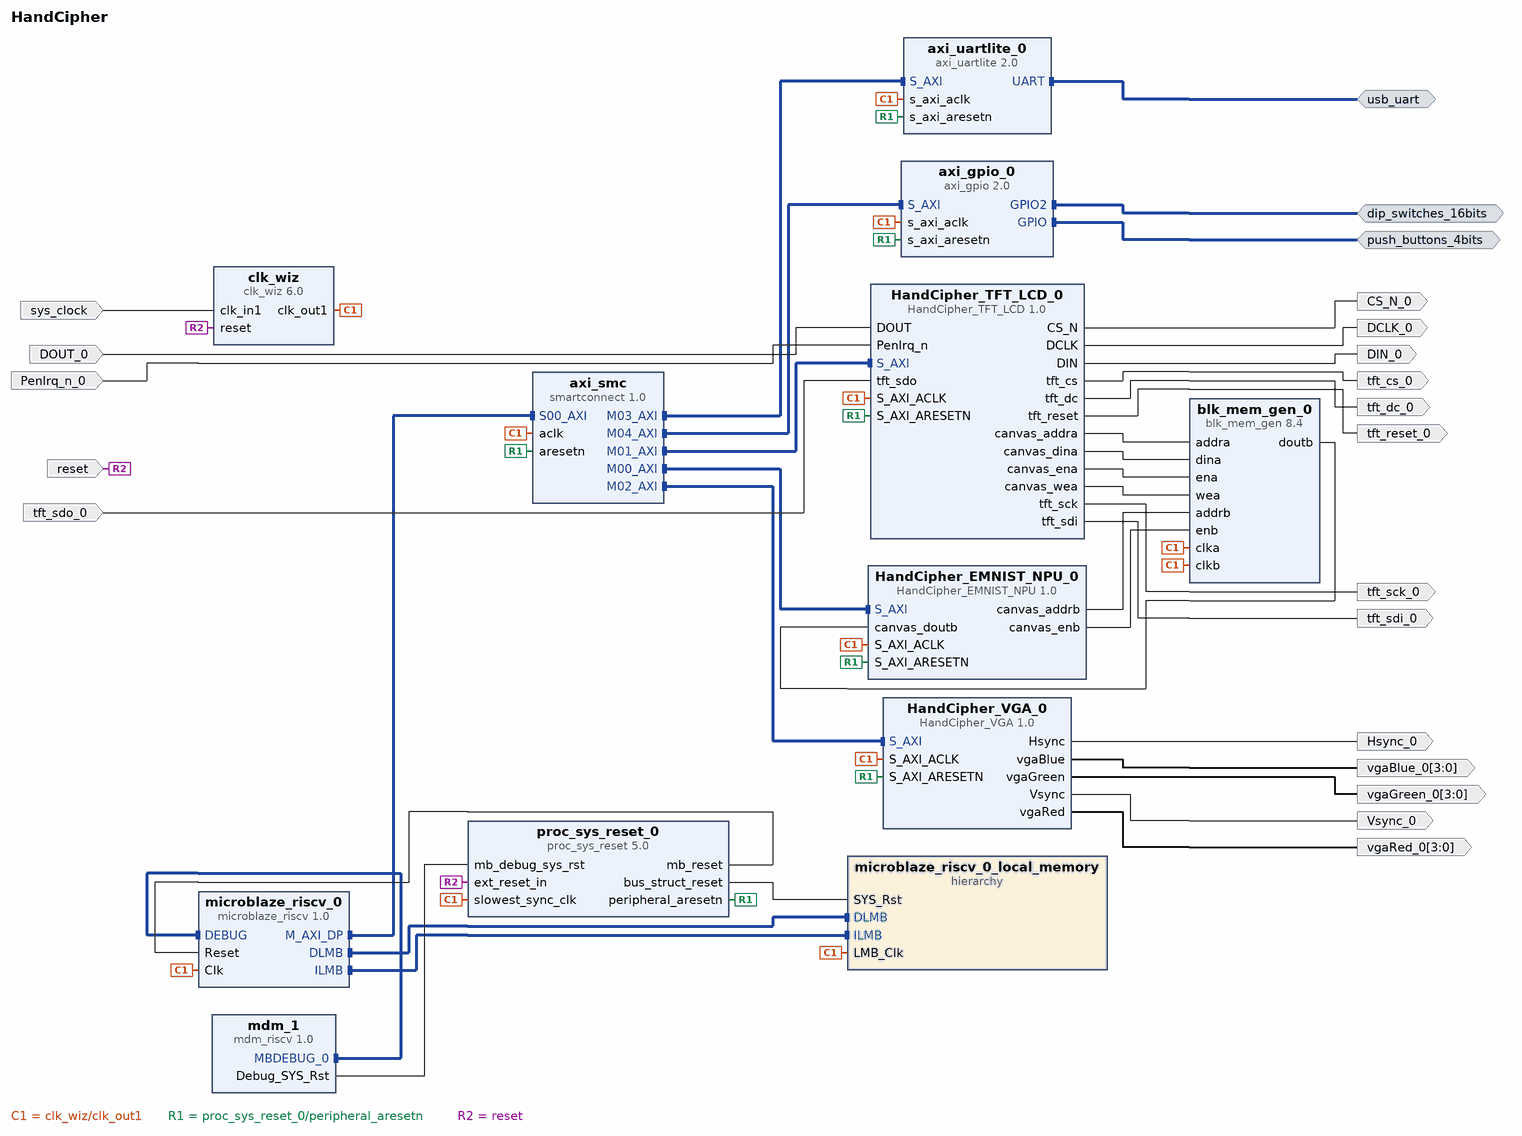
[diagram p0: block diagram of the top level]
# Vivado block design HandCipher, xc7a35tcpg236-1, Vivado 2024.2
create_bd_design HandCipher

create_bd_intf_port -mode Master -vlnv xilinx.com:interface:uart_rtl:1.0 usb_uart
create_bd_intf_port -mode Master -vlnv xilinx.com:interface:gpio_rtl:1.0 push_buttons_4bits
create_bd_intf_port -mode Master -vlnv xilinx.com:interface:gpio_rtl:1.0 dip_switches_16bits
create_bd_port -dir I -type rst reset
set_property -dict {CONFIG.POLARITY ACTIVE_HIGH} [get_bd_ports reset]
create_bd_port -dir I -type clk sys_clock
set_property -dict {CONFIG.FREQ_HZ 100000000 CONFIG.PHASE 0.0} [get_bd_ports sys_clock]
create_bd_port -dir I tft_sdo_0
create_bd_port -dir I PenIrq_n_0
create_bd_port -dir I DOUT_0
create_bd_port -dir O -from 3 -to 0 vgaRed_0
create_bd_port -dir O -from 3 -to 0 vgaGreen_0
create_bd_port -dir O -from 3 -to 0 vgaBlue_0
create_bd_port -dir O Hsync_0
create_bd_port -dir O Vsync_0
create_bd_port -dir O tft_sck_0
create_bd_port -dir O tft_sdi_0
create_bd_port -dir O tft_dc_0
create_bd_port -dir O -type rst tft_reset_0
create_bd_port -dir O tft_cs_0
create_bd_port -dir O DCLK_0
create_bd_port -dir O DIN_0
create_bd_port -dir O CS_N_0

create_bd_cell -type ip -vlnv xilinx.com:ip:proc_sys_reset:5.0 proc_sys_reset_0
set_property -dict {CONFIG.RESET_BOARD_INTERFACE reset CONFIG.USE_BOARD_FLOW true} [get_bd_cells proc_sys_reset_0]
create_bd_cell -type ip -vlnv xilinx.com:ip:clk_wiz:6.0 clk_wiz
set_property -dict [list \
  CONFIG.CLKOUT1_REQUESTED_OUT_FREQ 100.0 \
  CONFIG.CLK_IN1_BOARD_INTERFACE sys_clock \
  CONFIG.RESET_BOARD_INTERFACE reset \
  CONFIG.USE_BOARD_FLOW true \
] [get_bd_cells clk_wiz]
create_bd_cell -type ip -vlnv xilinx.com:ip:mdm_riscv:1.0 mdm_1
create_bd_cell -type ip -vlnv user.org:user:HandCipher_EMNIST_NPU:1.0 HandCipher_EMNIST_NPU_0
create_bd_cell -type ip -vlnv xilinx.com:ip:smartconnect:1.0 axi_smc
set_property -dict {CONFIG.NUM_MI 5 CONFIG.NUM_SI 1} [get_bd_cells axi_smc]
create_bd_cell -type ip -vlnv user.org:user:HandCipher_TFT_LCD:1.0 HandCipher_TFT_LCD_0
create_bd_cell -type ip -vlnv user.org:user:HandCipher_VGA:1.0 HandCipher_VGA_0
create_bd_cell -type ip -vlnv xilinx.com:ip:axi_uartlite:2.0 axi_uartlite_0
set_property -dict {CONFIG.UARTLITE_BOARD_INTERFACE usb_uart CONFIG.USE_BOARD_FLOW true} [get_bd_cells axi_uartlite_0]
create_bd_cell -type ip -vlnv xilinx.com:ip:blk_mem_gen:8.4 blk_mem_gen_0
set_property -dict [list \
  CONFIG.Memory_Type True_Dual_Port_RAM \
  CONFIG.Write_Depth_A 1024 \
  CONFIG.Write_Width_A 1 \
  CONFIG.use_bram_block Stand_Alone \
] [get_bd_cells blk_mem_gen_0]
create_bd_cell -type ip -vlnv xilinx.com:ip:microblaze_riscv:1.0 microblaze_riscv_0
set_property -dict {CONFIG.C_DEBUG_ENABLED 1 CONFIG.C_D_AXI 1 CONFIG.C_D_LMB 1 CONFIG.C_I_LMB 1} [get_bd_cells microblaze_riscv_0]
create_bd_cell -type hier microblaze_riscv_0_local_memory
create_bd_cell -type ip -vlnv xilinx.com:ip:axi_gpio:2.0 axi_gpio_0
set_property -dict [list \
  CONFIG.GPIO2_BOARD_INTERFACE dip_switches_16bits \
  CONFIG.GPIO_BOARD_INTERFACE push_buttons_4bits \
  CONFIG.USE_BOARD_FLOW true \
] [get_bd_cells axi_gpio_0]

# ---- hierarchy /microblaze_riscv_0_local_memory ----
current_bd_instance /microblaze_riscv_0_local_memory
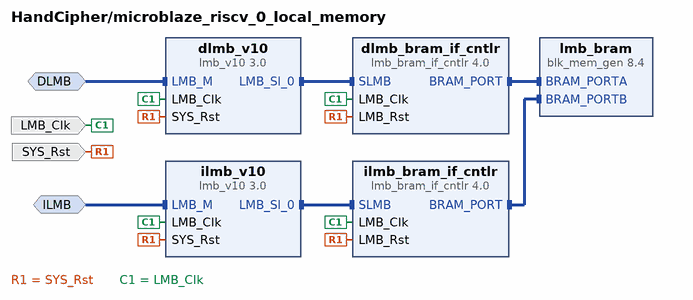
[diagram p1: block diagram inside /microblaze_riscv_0_local_memory]
create_bd_intf_pin -mode MirroredMaster -vlnv xilinx.com:interface:lmb_rtl:1.0 DLMB
create_bd_intf_pin -mode MirroredMaster -vlnv xilinx.com:interface:lmb_rtl:1.0 ILMB
create_bd_pin -dir I -type clk LMB_Clk
create_bd_pin -dir I -type rst SYS_Rst

create_bd_cell -type ip -vlnv xilinx.com:ip:lmb_v10:3.0 dlmb_v10
create_bd_cell -type ip -vlnv xilinx.com:ip:lmb_v10:3.0 ilmb_v10
create_bd_cell -type ip -vlnv xilinx.com:ip:lmb_bram_if_cntlr:4.0 dlmb_bram_if_cntlr
set_property -dict {CONFIG.C_ECC 0} [get_bd_cells dlmb_bram_if_cntlr]
create_bd_cell -type ip -vlnv xilinx.com:ip:lmb_bram_if_cntlr:4.0 ilmb_bram_if_cntlr
set_property -dict {CONFIG.C_ECC 0} [get_bd_cells ilmb_bram_if_cntlr]
create_bd_cell -type ip -vlnv xilinx.com:ip:blk_mem_gen:8.4 lmb_bram
set_property -dict {CONFIG.Memory_Type True_Dual_Port_RAM CONFIG.use_bram_block BRAM_Controller} [get_bd_cells lmb_bram]

# ---- connections ----

current_bd_instance /microblaze_riscv_0_local_memory
connect_bd_intf_net -intf_net microblaze_riscv_0_dlmb [get_bd_intf_pins dlmb_v10/LMB_M] [get_bd_intf_pins DLMB]
connect_bd_intf_net -intf_net microblaze_riscv_0_dlmb_bus [get_bd_intf_pins dlmb_v10/LMB_Sl_0] [get_bd_intf_pins dlmb_bram_if_cntlr/SLMB]
connect_bd_intf_net -intf_net microblaze_riscv_0_dlmb_cntlr [get_bd_intf_pins dlmb_bram_if_cntlr/BRAM_PORT] [get_bd_intf_pins lmb_bram/BRAM_PORTA]
connect_bd_intf_net -intf_net microblaze_riscv_0_ilmb [get_bd_intf_pins ilmb_v10/LMB_M] [get_bd_intf_pins ILMB]
connect_bd_intf_net -intf_net microblaze_riscv_0_ilmb_bus [get_bd_intf_pins ilmb_v10/LMB_Sl_0] [get_bd_intf_pins ilmb_bram_if_cntlr/SLMB]
connect_bd_intf_net -intf_net microblaze_riscv_0_ilmb_cntlr [get_bd_intf_pins ilmb_bram_if_cntlr/BRAM_PORT] [get_bd_intf_pins lmb_bram/BRAM_PORTB]
connect_bd_net [get_bd_pins SYS_Rst] \
  [get_bd_pins dlmb_v10/SYS_Rst] [get_bd_pins ilmb_v10/SYS_Rst] [get_bd_pins ilmb_bram_if_cntlr/LMB_Rst] \
  [get_bd_pins dlmb_bram_if_cntlr/LMB_Rst]
connect_bd_net -net microblaze_riscv_0_Clk [get_bd_pins LMB_Clk] \
  [get_bd_pins dlmb_v10/LMB_Clk] [get_bd_pins ilmb_v10/LMB_Clk] [get_bd_pins ilmb_bram_if_cntlr/LMB_Clk] \
  [get_bd_pins dlmb_bram_if_cntlr/LMB_Clk]
set_property HDL_ATTRIBUTE.BMM_INFO_ADDRESS_SPACE {byte  0x00000000 32 > HandCipher microblaze_riscv_0_local_memory/lmb_bram} [get_bd_cells dlmb_bram_if_cntlr]
set_property HDL_ATTRIBUTE.KEEP_HIERARCHY yes [get_bd_cells dlmb_bram_if_cntlr]

current_bd_instance /
connect_bd_intf_net [get_bd_intf_ports push_buttons_4bits] [get_bd_intf_pins axi_gpio_0/GPIO]
connect_bd_intf_net [get_bd_intf_ports dip_switches_16bits] [get_bd_intf_pins axi_gpio_0/GPIO2]
connect_bd_intf_net [get_bd_intf_pins axi_smc/M00_AXI] [get_bd_intf_pins HandCipher_EMNIST_NPU_0/S_AXI]
connect_bd_intf_net [get_bd_intf_pins axi_smc/M01_AXI] [get_bd_intf_pins HandCipher_TFT_LCD_0/S_AXI]
connect_bd_intf_net [get_bd_intf_pins axi_smc/M02_AXI] [get_bd_intf_pins HandCipher_VGA_0/S_AXI]
connect_bd_intf_net [get_bd_intf_pins axi_smc/M03_AXI] [get_bd_intf_pins axi_uartlite_0/S_AXI]
connect_bd_intf_net [get_bd_intf_pins axi_smc/M04_AXI] [get_bd_intf_pins axi_gpio_0/S_AXI]
connect_bd_intf_net [get_bd_intf_ports usb_uart] [get_bd_intf_pins axi_uartlite_0/UART]
connect_bd_intf_net [get_bd_intf_pins microblaze_riscv_0/M_AXI_DP] [get_bd_intf_pins axi_smc/S00_AXI]
connect_bd_intf_net [get_bd_intf_pins mdm_1/MBDEBUG_0] [get_bd_intf_pins microblaze_riscv_0/DEBUG]
connect_bd_intf_net [get_bd_intf_pins microblaze_riscv_0/DLMB] [get_bd_intf_pins microblaze_riscv_0_local_memory/DLMB]
connect_bd_intf_net [get_bd_intf_pins microblaze_riscv_0/ILMB] [get_bd_intf_pins microblaze_riscv_0_local_memory/ILMB]
connect_bd_net -net DOUT_0_1 [get_bd_ports DOUT_0] [get_bd_pins HandCipher_TFT_LCD_0/DOUT]
connect_bd_net [get_bd_pins HandCipher_EMNIST_NPU_0/canvas_addrb] [get_bd_pins blk_mem_gen_0/addrb]
connect_bd_net [get_bd_pins HandCipher_EMNIST_NPU_0/canvas_enb] [get_bd_pins blk_mem_gen_0/enb]
connect_bd_net [get_bd_pins HandCipher_TFT_LCD_0/CS_N] [get_bd_ports CS_N_0]
connect_bd_net [get_bd_pins HandCipher_TFT_LCD_0/DCLK] [get_bd_ports DCLK_0]
connect_bd_net [get_bd_pins HandCipher_TFT_LCD_0/DIN] [get_bd_ports DIN_0]
connect_bd_net [get_bd_pins HandCipher_TFT_LCD_0/canvas_addra] [get_bd_pins blk_mem_gen_0/addra]
connect_bd_net [get_bd_pins HandCipher_TFT_LCD_0/canvas_dina] [get_bd_pins blk_mem_gen_0/dina]
connect_bd_net [get_bd_pins HandCipher_TFT_LCD_0/canvas_ena] [get_bd_pins blk_mem_gen_0/ena]
connect_bd_net [get_bd_pins HandCipher_TFT_LCD_0/canvas_wea] [get_bd_pins blk_mem_gen_0/wea]
connect_bd_net [get_bd_pins HandCipher_TFT_LCD_0/tft_cs] [get_bd_ports tft_cs_0]
connect_bd_net [get_bd_pins HandCipher_TFT_LCD_0/tft_dc] [get_bd_ports tft_dc_0]
connect_bd_net [get_bd_pins HandCipher_TFT_LCD_0/tft_reset] [get_bd_ports tft_reset_0]
connect_bd_net [get_bd_pins HandCipher_TFT_LCD_0/tft_sck] [get_bd_ports tft_sck_0]
connect_bd_net [get_bd_pins HandCipher_TFT_LCD_0/tft_sdi] [get_bd_ports tft_sdi_0]
connect_bd_net [get_bd_pins HandCipher_VGA_0/Hsync] [get_bd_ports Hsync_0]
connect_bd_net [get_bd_pins HandCipher_VGA_0/Vsync] [get_bd_ports Vsync_0]
connect_bd_net [get_bd_pins HandCipher_VGA_0/vgaBlue] [get_bd_ports vgaBlue_0]
connect_bd_net [get_bd_pins HandCipher_VGA_0/vgaGreen] [get_bd_ports vgaGreen_0]
connect_bd_net [get_bd_pins HandCipher_VGA_0/vgaRed] [get_bd_ports vgaRed_0]
connect_bd_net -net PenIrq_n_0_1 [get_bd_ports PenIrq_n_0] [get_bd_pins HandCipher_TFT_LCD_0/PenIrq_n]
connect_bd_net [get_bd_pins blk_mem_gen_0/doutb] [get_bd_pins HandCipher_EMNIST_NPU_0/canvas_doutb]
connect_bd_net [get_bd_pins mdm_1/Debug_SYS_Rst] [get_bd_pins proc_sys_reset_0/mb_debug_sys_rst]
connect_bd_net -net microblaze_riscv_0_Clk [get_bd_pins clk_wiz/clk_out1] \
  [get_bd_pins proc_sys_reset_0/slowest_sync_clk] [get_bd_pins HandCipher_EMNIST_NPU_0/S_AXI_ACLK] \
  [get_bd_pins HandCipher_TFT_LCD_0/S_AXI_ACLK] [get_bd_pins HandCipher_VGA_0/S_AXI_ACLK] \
  [get_bd_pins axi_uartlite_0/s_axi_aclk] [get_bd_pins blk_mem_gen_0/clka] [get_bd_pins blk_mem_gen_0/clkb] \
  [get_bd_pins microblaze_riscv_0/Clk] [get_bd_pins microblaze_riscv_0_local_memory/LMB_Clk] \
  [get_bd_pins axi_gpio_0/s_axi_aclk] [get_bd_pins axi_smc/aclk]
connect_bd_net [get_bd_pins proc_sys_reset_0/bus_struct_reset] [get_bd_pins microblaze_riscv_0_local_memory/SYS_Rst]
connect_bd_net [get_bd_pins proc_sys_reset_0/mb_reset] [get_bd_pins microblaze_riscv_0/Reset]
connect_bd_net [get_bd_pins proc_sys_reset_0/peripheral_aresetn] \
  [get_bd_pins HandCipher_EMNIST_NPU_0/S_AXI_ARESETN] [get_bd_pins HandCipher_TFT_LCD_0/S_AXI_ARESETN] \
  [get_bd_pins HandCipher_VGA_0/S_AXI_ARESETN] [get_bd_pins axi_uartlite_0/s_axi_aresetn] \
  [get_bd_pins axi_gpio_0/s_axi_aresetn] [get_bd_pins axi_smc/aresetn]
connect_bd_net [get_bd_ports reset] [get_bd_pins proc_sys_reset_0/ext_reset_in] [get_bd_pins clk_wiz/reset]
connect_bd_net [get_bd_ports sys_clock] [get_bd_pins clk_wiz/clk_in1]
connect_bd_net -net tft_sdo_0_1 [get_bd_ports tft_sdo_0] [get_bd_pins HandCipher_TFT_LCD_0/tft_sdo]
set_property HDL_ATTRIBUTE.BMM_INFO_PROCESSOR {riscv > HandCipher microblaze_riscv_0_local_memory/dlmb_bram_if_cntlr} [get_bd_cells microblaze_riscv_0]
set_property HDL_ATTRIBUTE.KEEP_HIERARCHY yes [get_bd_cells microblaze_riscv_0]

# ---- address map ----
assign_bd_address -offset 0x00000000 -range 128K -target_address_space [get_bd_addr_spaces microblaze_riscv_0/Data] [get_bd_addr_segs microblaze_riscv_0_local_memory/dlmb_bram_if_cntlr/SLMB/Mem]
assign_bd_address -offset 0x00020000 -range 4K -target_address_space [get_bd_addr_spaces microblaze_riscv_0/Data] [get_bd_addr_segs HandCipher_EMNIST_NPU_0/S_AXI/reg0]
assign_bd_address -offset 0x00021000 -range 4K -target_address_space [get_bd_addr_spaces microblaze_riscv_0/Data] [get_bd_addr_segs HandCipher_VGA_0/S_AXI/reg0]
assign_bd_address -offset 0x00030000 -range 4K -target_address_space [get_bd_addr_spaces microblaze_riscv_0/Data] [get_bd_addr_segs HandCipher_TFT_LCD_0/S_AXI/reg0]
assign_bd_address -offset 0x40000000 -range 64K -target_address_space [get_bd_addr_spaces microblaze_riscv_0/Data] [get_bd_addr_segs axi_gpio_0/S_AXI/Reg]
assign_bd_address -offset 0x40600000 -range 64K -target_address_space [get_bd_addr_spaces microblaze_riscv_0/Data] [get_bd_addr_segs axi_uartlite_0/S_AXI/Reg]
assign_bd_address -offset 0x00000000 -range 128K -target_address_space [get_bd_addr_spaces microblaze_riscv_0/Instruction] [get_bd_addr_segs microblaze_riscv_0_local_memory/ilmb_bram_if_cntlr/SLMB/Mem]

validate_bd_design
save_bd_design
